# EAGLE schematic spectrometer (EAGLE 9.6.2)
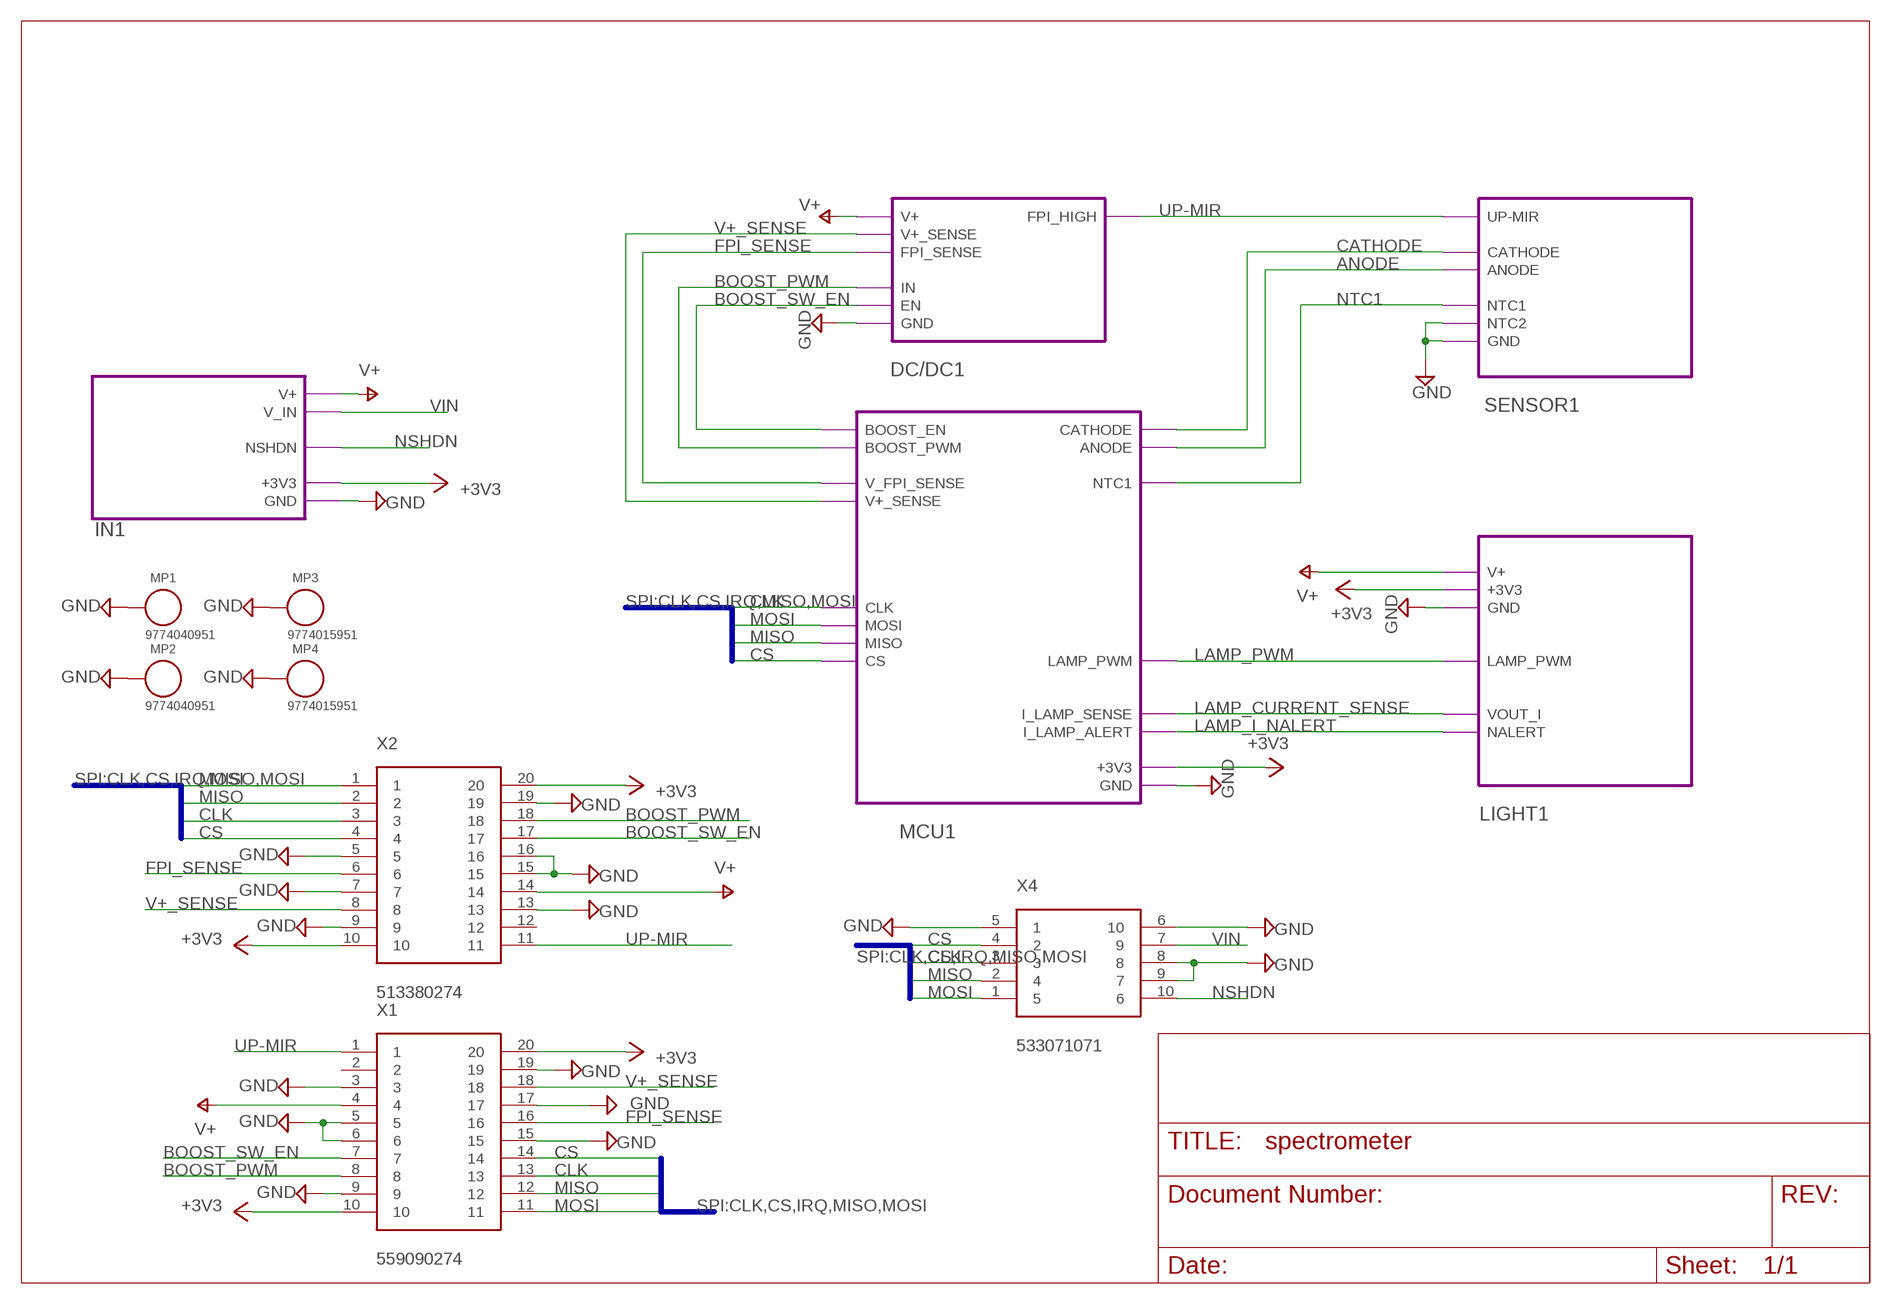
[diagram p0: schematic, sheet 1]

## Parts
MP1  9774040951  WA-SMST_9774XXX951_9774040951  [WA-SMST_9774040951]
MP2  9774040951  WA-SMST_9774XXX951_9774040951  [WA-SMST_9774040951]
MP3  9774015951  WA-SMST_9774XXX951_9774015951  [WA-SMST_9774015951]
MP4  9774015951  WA-SMST_9774XXX951_9774015951  [WA-SMST_9774015951]
X1  559090274  [559090274]
X2  513380274  513380274SIMPLE  [513380274]
X4  533071071  533071071SMD  [533071071]

## Module instances
DC/DC1 = VOLTAGE_BOOST
SENSOR1 = MEMS_FPI
IN1 = INPUT_VOLTAGE
MCU1 = MICROCONTROLLER
LIGHT1 = LIGHT_BULB

## Nets
+3V3: X1.10 X1.20 X2.10 X2.20 ; port LIGHT1.+3V3 MCU1.+3V3 IN1.+3V3
ANODE: port MCU1.ANODE SENSOR1.ANODE
BOOST_PWM: X1.8 X2.18 ; port DC/DC1.IN MCU1.BOOST_PWM
BOOST_SW_EN: X1.7 X2.17 ; port MCU1.BOOST_EN DC/DC1.EN
CATHODE: port SENSOR1.CATHODE MCU1.CATHODE
CLK: X1.13 X2.3 X4.3 ; port MCU1.CLK
CS: X1.14 X2.4 X4.4 ; port MCU1.CS
FPI_SENSE: X1.16 X2.6 ; port MCU1.V_FPI_SENSE DC/DC1.FPI_SENSE
GND: MP1.1 MP2.1 MP3.1 MP4.1 X1.3 X1.5 X1.6 X1.9 X1.15 X1.17 X1.19 X2.5 X2.7 X2.9 X2.13 X2.15 X2.16 X2.19 X4.5 X4.6 X4.8 X4.9 ; port SENSOR1.GND SENSOR1.NTC2 LIGHT1.GND DC/DC1.GND MCU1.GND IN1.GND
LAMP_CURRENT_SENSE: port LIGHT1.VOUT_I MCU1.I_LAMP_SENSE
LAMP_I_NALERT: port LIGHT1.NALERT MCU1.I_LAMP_ALERT
LAMP_PWM: port MCU1.LAMP_PWM LIGHT1.LAMP_PWM
MISO: X1.12 X2.2 X4.2 ; port MCU1.MISO
MOSI: X1.11 X2.1 X4.1 ; port MCU1.MOSI
NSHDN: X4.10 ; port IN1.NSHDN
NTC1: port SENSOR1.NTC1 MCU1.NTC1
UP-MIR: X1.1 X2.11 ; port SENSOR1.UP-MIR DC/DC1.FPI_HIGH
V+: X1.4 X2.14 ; port LIGHT1.V+ DC/DC1.V+ IN1.V+
V+_SENSE: X1.18 X2.8 ; port DC/DC1.V+_SENSE MCU1.V+_SENSE
VIN: X4.7 ; port IN1.V_IN
Unconnected: X1.2 X2.12

## Buses
SPI:CLK,CS,IRQ,MISO,MOSI

## Library data of the parts
MP1 MP2 = Wurth_Assembly_WA-SMST:WA-SMST_9774XXX951: WA-SMST SMT Steel Spacer Ø 2.7 Internal non stop Applications ple and fast automated assembly For distances from 1 to 10 mm With non stop internal diameter 2.7 mm High mechanical strength PROPERTIES Material Steel Surface Tin PACKAGING PROPERTIES Packaging Bag;​ Tape and Reel;​ Bulk Packaging Unit 450 <https://katalog.we-online.de/media/images/v2/o64624v209%20Family_SMD-Abstandsbolzen.jpg> Details see: https://katalog.we-online.de/en/em/SMST_SMD_STEEL_SPACER_2_7_INTERNAL_NON_STOP Updated by Ella Wu , 2020-05-18 2020 (C) Wurth Elektronik; DATASHEET-URL: https://www.we-online.com/catalog/datasheet/9774040951.pdf; HOLE-DIAMETER: 2.7mm; INNER-DIAMETER: 3.5mm; OUTER-DIAMETER: 5.1mm; PART-NUMBER: 9774040951; PIN-LENGTH: 4mm
MP3 MP4 = Wurth_Assembly_WA-SMST:WA-SMST_9774XXX951: WA-SMST SMT Steel Spacer Ø 2.7 Internal non stop Applications ple and fast automated assembly For distances from 1 to 10 mm With non stop internal diameter 2.7 mm High mechanical strength PROPERTIES Material Steel Surface Tin PACKAGING PROPERTIES Packaging Bag;​ Tape and Reel;​ Bulk Packaging Unit 450 <https://katalog.we-online.de/media/images/v2/o64624v209%20Family_SMD-Abstandsbolzen.jpg> Details see: https://katalog.we-online.de/en/em/SMST_SMD_STEEL_SPACER_2_7_INTERNAL_NON_STOP Updated by Ella Wu , 2020-05-18 2020 (C) Wurth Elektronik; DATASHEET-URL: https://www.we-online.com/catalog/datasheet/9774015951.pdf; HOLE-DIAMETER: 2.7mm; INNER-DIAMETER: 3.5mm; OUTER-DIAMETER: 5.1mm; PART-NUMBER: 9774015951; PIN-LENGTH: 1.5mm
X1 = connectors:559090274: 559090274 SlimStack Board-to-Board Plug, 0.40mm Pitch, J-Bend Series, 0.20µm Gold (Au) Plating, 1.50 or 1.80mm Mated Height, 3.40 or 4.20mm Mated Width, 20 Circuits
X2 = connectors:513380274: 513380274 SlimStack Board-to-Board Receptacle, 0.40mm Pitch, J-Bend Series, 0.20µm Gold (Au) Plating, 1.50 or 2.00mm Mated Height, 3.40mm Mated Width, 20 Circuits
X4 = connectors:533071071: 533071071 SlimStack Board-to-Board Connector, 0.80mm Pitch, Floating Series, Plug, 4.50 or 5.50mm Mated Height, 10 Circuits, Vertical, without Boss

## Module VOLTAGE_BOOST
Ports: FPI_HIGH(io) GND(io) V+(io) V+_SENSE(io) FPI_SENSE(io) IN(io) EN(io)
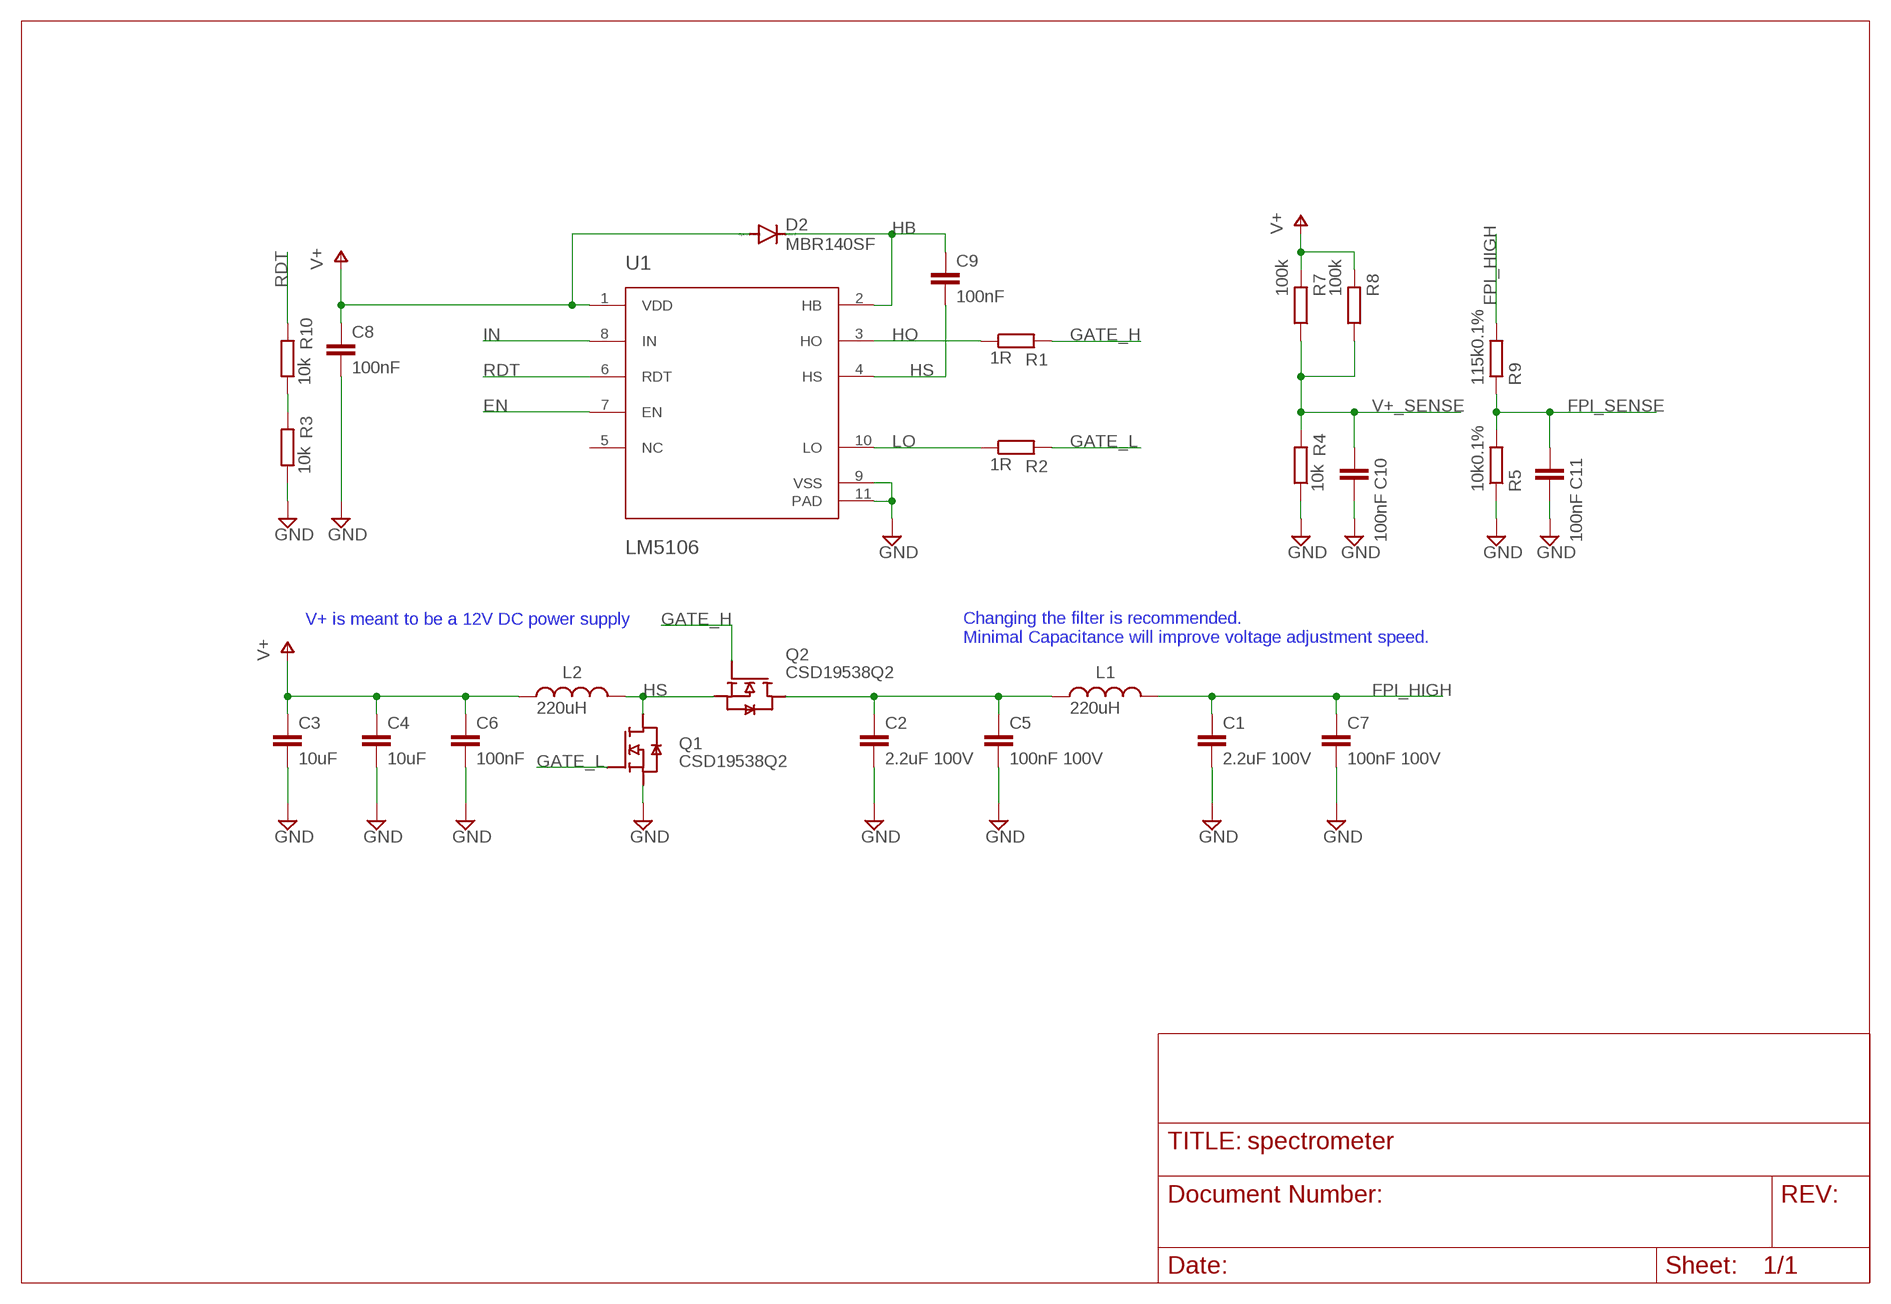
[diagram p1: schematic, module VOLTAGE_BOOST, sheet 1]

### Parts
C1  2.2uF 100V  C-EUC1210K  [C1210K]
C2  2.2uF 100V  C-EUC1210K  [C1210K]
C3  10uF  C-EUC1210K  [C1210K]
C4  10uF  C-EUC1210K  [C1210K]
C5  100nF 100V  C-EUC0603K  [C0603K]
C6  100nF  C-EUC0603K  [C0603K]
C7  100nF 100V  C-EUC0603K  [C0603K]
C8  100nF  C-EUC0603K  [C0603K]
C9  100nF  C-EUC0603K  [C0603K]
C10  100nF  C-EUC0402  [C0402]
C11  100nF  C-EUC0402  [C0402]
D2  MBR140SF  MBR0520LT  [SOD123]
L1  220uH  WE-LQ_1210_744032221  [WE-LQ_1210]
L2  220uH  WE-LQ_1210_744032221  [WE-LQ_1210]
Q1  CSD19538Q2  CSD19538Q2SON  [DQK0006C]
Q2  CSD19538Q2  CSD19538Q2SON  [DQK0006C]
R1  1R  R-EU_R0402  [R0402]
R2  1R  R-EU_R0402  [R0402]
R3  10k  R-EU_R0402  [R0402]
R4  10k  R-EU_R0402  [R0402]
R5  10k0.1%  R-EU_R0402  [R0402]
R7  100k  R-EU_R0402  [R0402]
R8  100k  R-EU_R0402  [R0402]
R9  115k0.1%  R-EU_R0402  [R0402]
R10  10k  R-EU_R0402  [R0402]
U1  LM5106  LM5106SD/NOPBWSON  [DPR0010A]

### Nets
EN: U1.7(EN)
FPI_HIGH: C1.1 C7.1 L1.2 R9.2
FPI_SENSE: C11.1 R5.2 R9.1
GATE_H: Q2.3(G) R1.2
GATE_L: Q1.3(G) R2.2
GND: C1.2 C2.2 C3.2 C4.2 C5.2 C6.2 C7.2 C8.2 C10.2 C11.2 Q1.4(S) Q1.7(S) R3.1 R4.1 R5.1 U1.9(VSS) U1.11(PAD)
HB: C9.1 D2.C U1.2(HB)
HO: R1.1 U1.3(HO)
HS: C9.2 L2.2 Q1.1(D) Q1.2(D) Q1.5(D) Q1.6(D) Q1.8(D) Q2.4(S) Q2.7(S) U1.4(HS)
IN: U1.8(IN)
LO: R2.1 U1.10(LO)
N$1: C2.1 C5.1 L1.1 Q2.1(D) Q2.2(D) Q2.5(D) Q2.6(D) Q2.8(D)
N$3: R3.2 R10.1
RDT: R10.2 U1.6(RDT)
V+: C3.1 C4.1 C6.1 C8.1 D2.A L2.1 R7.2 R8.2 U1.1(VDD)
V+_SENSE: C10.1 R4.2 R7.1 R8.1
Unconnected: U1.5(NC)

### Notes on the sheet
- V+ is meant to be a 12V DC power supply
- Changing the filter is recommended. 
  Minimal Capacitance will improve voltage adjustment speed.

### Library data of the parts
C1-C11 = rcl:C-EU: CAPACITOR, European symbol; SPICEPREFIX: C
D2 = diode:MBR0520LT: SCHOTTKY BARRIER RECTIFIER Source: http://onsemi.com .. MBR0520LT1-D.pdf
L1 L2 = Wurth_Power Magnetics_WE-LQ:WE-LQ_1210: WE-LQ SMD Inductor Characteristics Miniature chip inductor wound on a special ferrite core Small inductances for compact circuits High Q at high frequencies Low DC-resistance Operating temperature: –40 ºC to +125 ºC Recommended solder profile: Reflow Applications Low power DC/DC-converters from Linear Technology, National Semiconductor, Texas Instruments, Fairchild Semiconductor, ON Semiconductor, STMicroelectronics, Maxim, MPS, Semtech, Exar, Analogic Tech, Diodes and Cologne Chip EMI-Filtering RF-circuits <https://katalog.we-online.com/media/images/v2/o14806v209%20Family_we-lq_smd_induktivitaet.jpg> Details see: https://katalog.we-online.com/en/pbs/WE-LQ Updated by Yingchun Shan 2019-07-16 2019 (C) Wurth Elektronik; DATASHEET-URL: https://katalog.we-online.com/pbs/datasheet/744032221.pdf; FRES: 5MHz; IR: 0.075A; ISAT: 0.24A; PART-NUMBER: 744032221; Q: 40; RDC-MAX: 11.8Ohm
Q1 Q2 = spectrometer:CSD19538Q2; DATASHEET_URL: http://sps06.itg.ti.com/sites/KMS/crossdivteams/altium/docs/ComponentDatasheets/CSD19538Q2.pdf; IDSMAX: 15.0; MANUFACTURER_PART_NUMBER: CSD19538Q2; QGTYP: 7.2; QUANTITY: 1; RDSON45: 0.06608; VDSMAX: 100.0; VENDOR: Texas Instruments
R1-R5 R7-R10 = rcl:R-EU_: RESISTOR, European symbol; SPICEPREFIX: R
U1 = spectrometer:LM5106SD/NOPB: LM5106 The LM5106 is a high voltage gate driver designed to drive both the high side and low side N-Channel MOSFETs in a synchronous buck or half bridge configuration. The floating high side driver is capable of working with rail voltages up to 100V. The single control input is compatible with TTL signal levels and a single external resistor programs the switching transition dead-time through tightly matched turn-on delay circuits. The robust level shift technology operates at high speed while consuming low power and provides clean output transitions. Under-voltage lockout disables the gate driver when either the low side or the bootstrapped high side supply voltage is below the operating threshold. The LM5106 is offered in the VSSOP-10 or thermally enhanced 10-pin WSON plastic package.; MANUFACTURER: Texas Instruments; PARTNUMBER: LM5106SDX/NOPB; REFDES: RefDes; TYPE: TYPE

## Module MEMS_FPI
Ports: UP-MIR(io) ANODE(io) CATHODE(io) GND(io) NTC1(io) NTC2(io)
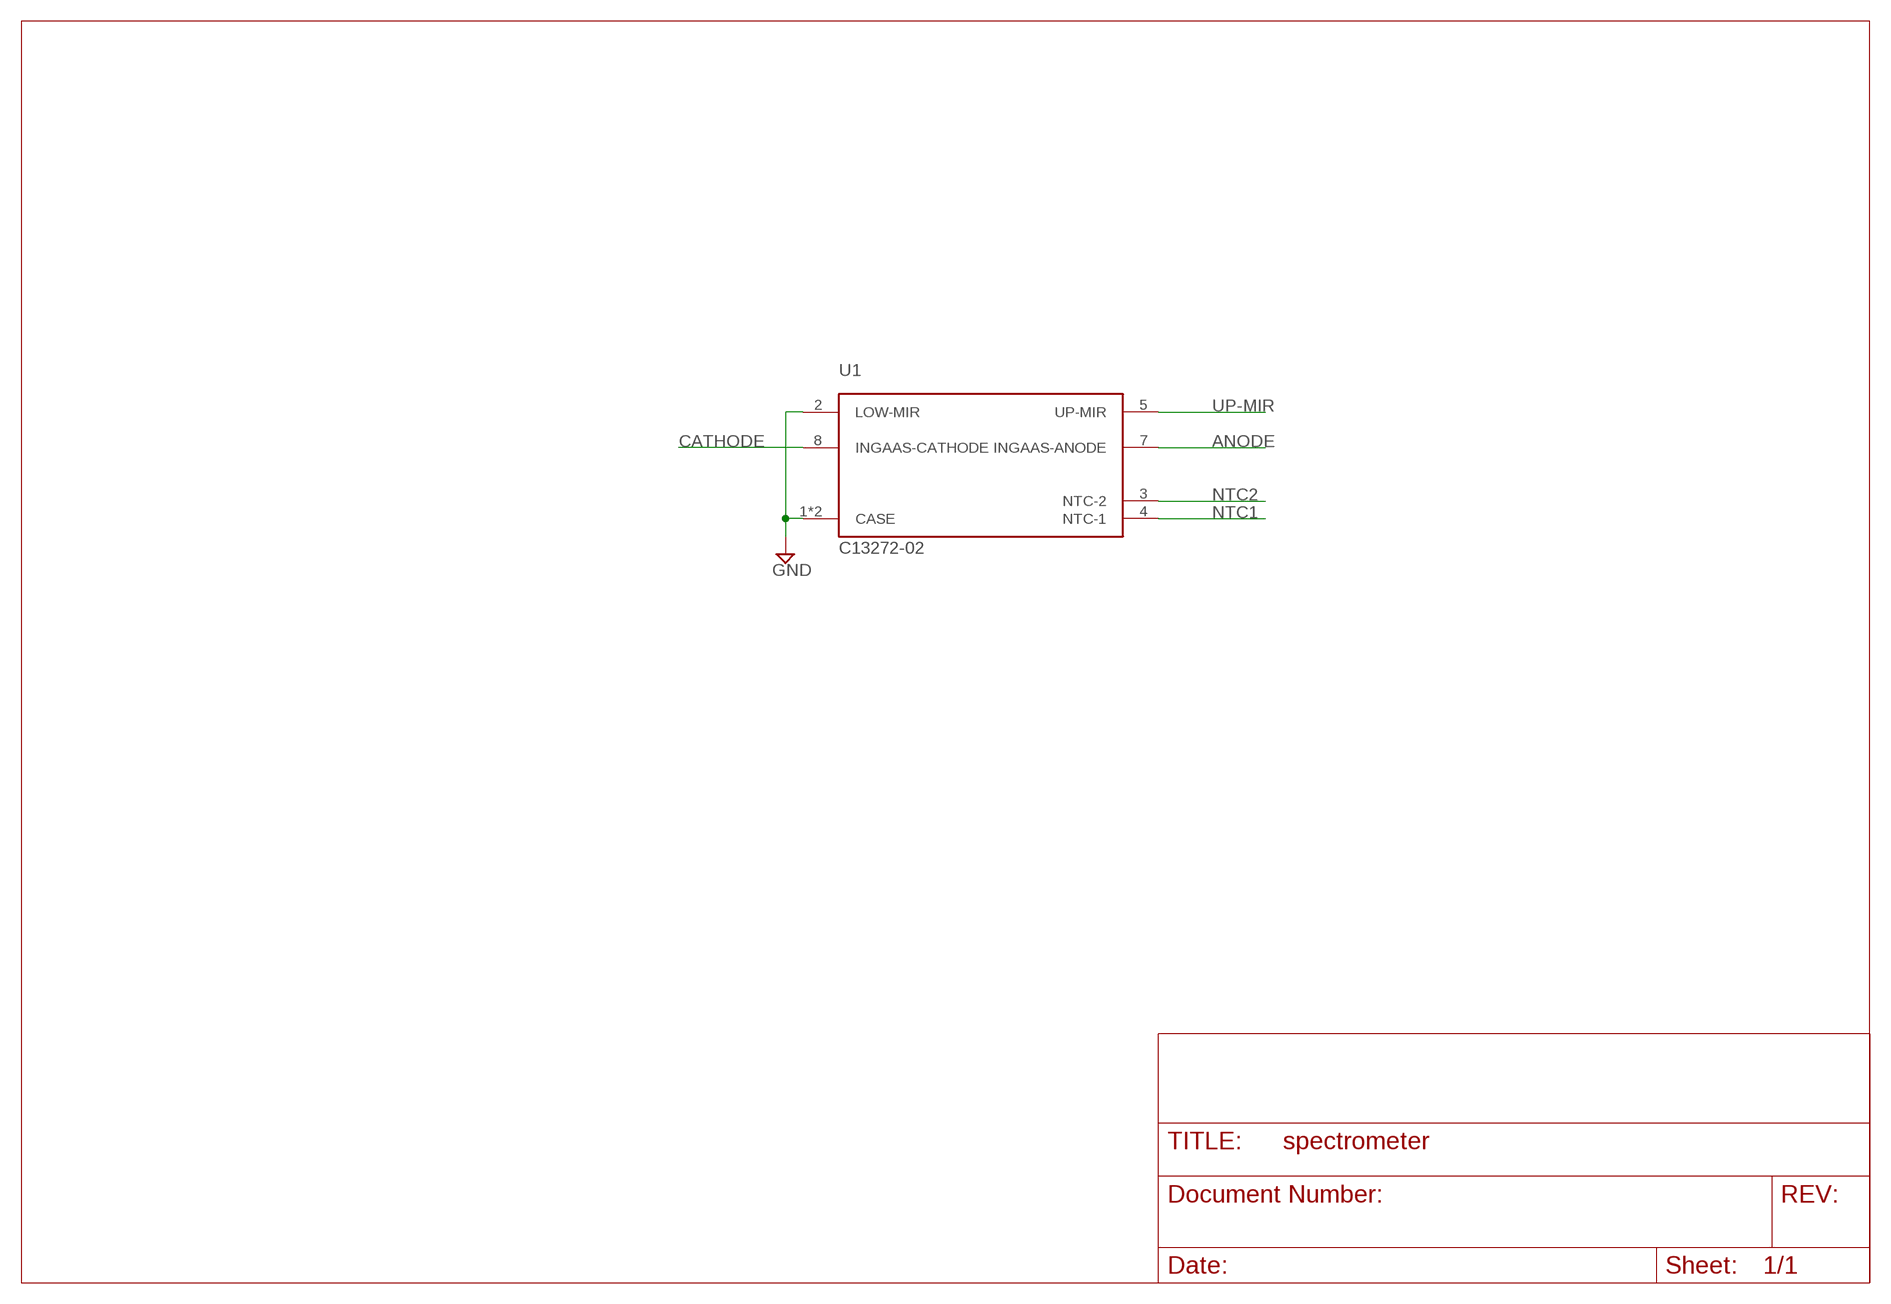
[diagram p2: schematic, module MEMS_FPI, sheet 1]

### Parts
U1  C13272-02  C13272-028PIN  [C13272-02]

### Nets
ANODE: U1.7(INGAAS-ANODE)
CATHODE: U1.8(INGAAS-CATHODE)
GND: U1.1(CASE) U1.2(LOW-MIR) U1.6(CASE)
NTC1: U1.4(NTC-1)
NTC2: U1.3(NTC-2)
UP-MIR: U1.5(UP-MIR)

### Library data of the parts
U1 = spectrometer:C13272-02: C13272-02 The MEMS-FPI spectrum sensor is a ultra-compact sensor that houses a MEMS-FPI (Fabry-Perot Interferometer) tunable filter that can vary its transmission wavelength depending on the applied voltage and InGaAs PIN photodiode in a single package. The spectral response range is 1550 to 1850 nm. It is suitable for installation in compact devices for identifying materials in plastic and solutions and other similar applications.

## Module INPUT_VOLTAGE
Ports: GND(io) +3V3(io) V+(io) V_IN(io) NSHDN(io)
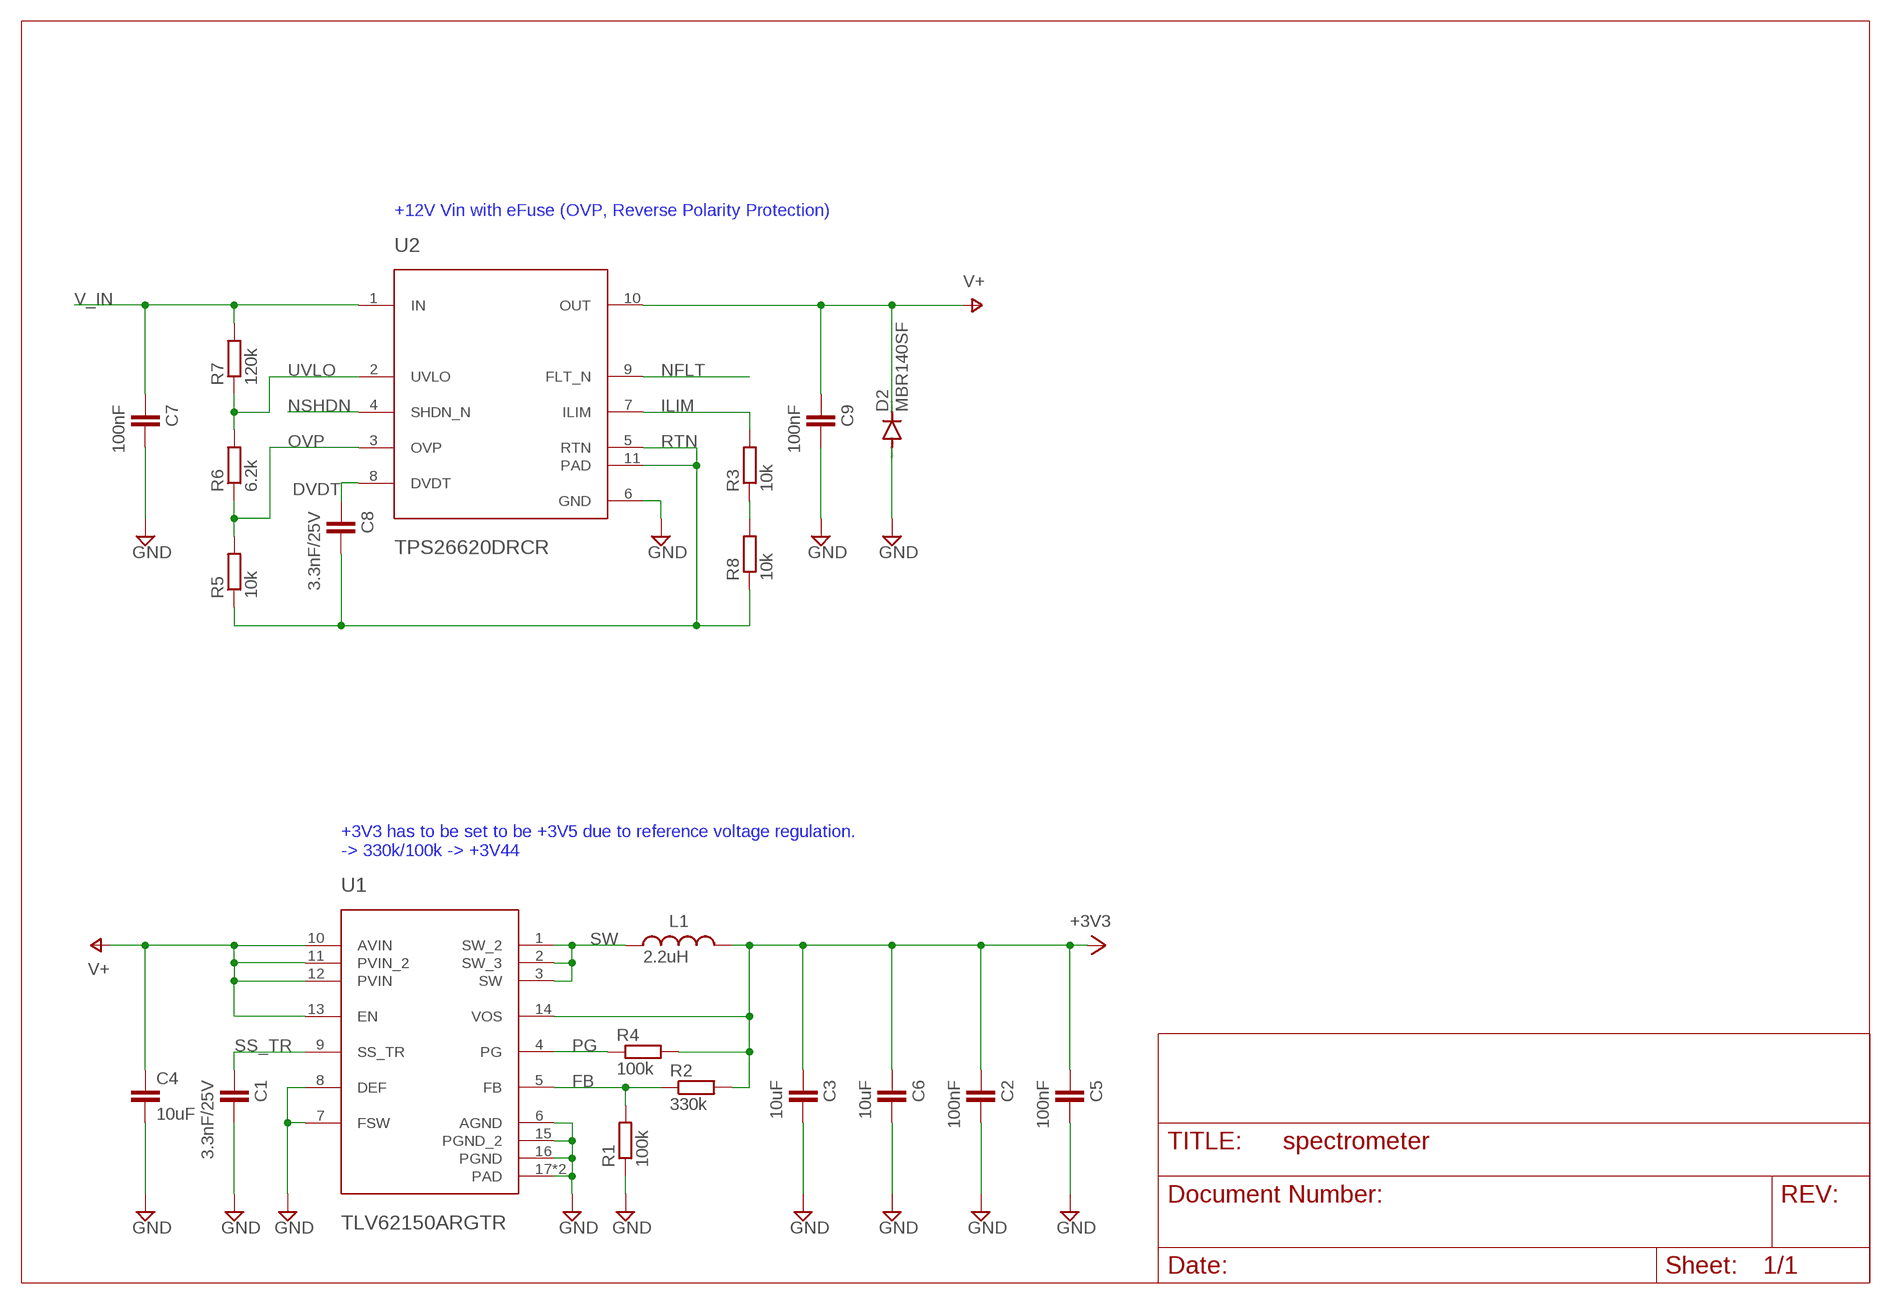
[diagram p3: schematic, module INPUT_VOLTAGE, sheet 1]

### Parts
C1  3.3nF/25V  C-EUC0402  [C0402]
C2  100nF  C-EUC0402  [C0402]
C3  10uF  C-EUC0603K  [C0603K]
C4  10uF  C-EUC1210K  [C1210K]
C5  100nF  C-EUC0402  [C0402]
C6  10uF  C-EUC0603K  [C0603K]
C7  100nF  C-EUC0603K  [C0603K]
C8  3.3nF/25V  C-EUC0402  [C0402]
C9  100nF  C-EUC0603K  [C0603K]
D2  MBR140SF  MBR0520LT  [SOD123]
L1  2.2uH  WE-LQ_1210_744032002  [WE-LQ_1210]
R1  100k  R-EU_R0402  [R0402]
R2  330k  R-EU_R0402  [R0402]
R3  10k  R-EU_R0402  [R0402]
R4  100k  R-EU_R0402  [R0402]
R5  10k  R-EU_R0402  [R0402]
R6  6.2k  R-EU_R0402  [R0402]
R7  120k  R-EU_R0402  [R0402]
R8  10k  R-EU_R0402  [R0402]
U1  TLV62150ARGTR  TLV62150ARGTRQFN16  [RGT0016C]
U2  TPS26620DRCR  TPS26620DRCRQFN-10  [DRC0010J]

### Nets
+3V3: C2.1 C3.1 C5.1 C6.1 L1.2 R2.2 R4.2 U1.14(VOS)
DVDT: C8.1 U2.8(DVDT)
FB: R1.2 R2.1 U1.5(FB)
GND: C1.2 C2.2 C3.2 C4.2 C5.2 C6.2 C7.2 C9.2 D2.A R1.1 U1.6(AGND) U1.7(FSW) U1.8(DEF) U1.15(PGND_2) U1.16(PGND) U1.17(PAD) U1.18(PAD) U2.6(GND)
ILIM: R3.2 U2.7(ILIM)
N$3: R3.1 R8.2
NFLT: U2.9(FLT_N)
NSHDN: U2.4(SHDN_N)
OVP: R5.2 R6.1 U2.3(OVP)
PG: R4.1 U1.4(PG)
RTN: C8.2 R5.1 R8.1 U2.5(RTN) U2.11(PAD)
SS_TR: C1.1 U1.9(SS_TR)
SW: L1.1 U1.1(SW_2) U1.2(SW_3) U1.3(SW)
UVLO: R6.2 R7.1 U2.2(UVLO)
V+: C4.1 C9.1 D2.C U1.10(AVIN) U1.11(PVIN_2) U1.12(PVIN) U1.13(EN) U2.10(OUT)
V_IN: C7.1 R7.2 U2.1(IN)

### Notes on the sheet
- +12V Vin with eFuse (OVP, Reverse Polarity Protection)
- +3V3 has to be set to be +3V5 due to reference voltage regulation.
  -> 330k/100k -> +3V44

### Library data of the parts
C1-C9 = rcl:C-EU: CAPACITOR, European symbol; SPICEPREFIX: C
D2 = diode:MBR0520LT: SCHOTTKY BARRIER RECTIFIER Source: http://onsemi.com .. MBR0520LT1-D.pdf
L1 = Wurth_Power Magnetics_WE-LQ:WE-LQ_1210: WE-LQ SMD Inductor Characteristics Miniature chip inductor wound on a special ferrite core Small inductances for compact circuits High Q at high frequencies Low DC-resistance Operating temperature: –40 ºC to +125 ºC Recommended solder profile: Reflow Applications Low power DC/DC-converters from Linear Technology, National Semiconductor, Texas Instruments, Fairchild Semiconductor, ON Semiconductor, STMicroelectronics, Maxim, MPS, Semtech, Exar, Analogic Tech, Diodes and Cologne Chip EMI-Filtering RF-circuits <https://katalog.we-online.com/media/images/v2/o14806v209%20Family_we-lq_smd_induktivitaet.jpg> Details see: https://katalog.we-online.com/en/pbs/WE-LQ Updated by Yingchun Shan 2019-07-16 2019 (C) Wurth Elektronik; DATASHEET-URL: https://katalog.we-online.com/pbs/datasheet/744032002.pdf; FRES: 50MHz; IR: 0.62A; ISAT: 1.8A; PART-NUMBER: 744032002; Q: 20; RDC-MAX: 0.15Ohm
R1-R8 = rcl:R-EU_: RESISTOR, European symbol; SPICEPREFIX: R
U1 = spectrometer:TLV62150ARGTR: TLV62150x The TLV62150x device is an easy-to-use synchronous step-down DC-DC converter optimized for applications with high power density. A high switching frequency of typically 2.5 MHz allows the use of small inductors and provides fast transient response as well as high output voltage accuracy by use of the DCS-ControlTM topology. With their wide operating input voltage range of 4 V to 17 V, the devices are ideally suited for systems powered from either a Li-Ion or other batteries as well as from 12 V intermediate power rails. It supports up to 1-A continuous output current at output voltages between 0.9 V and 5 V (with 100% duty cycle mode). The output voltage startup ramp is controlled by the soft-start pin, which allows operation as either a standalone power supply or in tracking configurations. Power sequencing is also possible by configuring the Enable and open-drain Power Good pins. In Power Save Mode, the devices draw quiescent current of about 19 μA from VIN. Power Save Mode, entered automatically and seamlessly if load is small, maintains high efficiency over the entire load range. In Shutdown Mode, the device is turned off and shutdown current consumption is less than 2 μA. The devices is packaged in a 16-pin VQFN package measuring 3 mm × 3 mm (RGT).; MANUFACTURER: Texas Instruments; PARTNUMBER: TLV62150ARGTR; REFDES: RefDes; TYPE: TYPE; VALUE: Value
U2 = spectrometer:TPS26620DRCR: TPS2662x The TPS2662x family are compact, feature rich high voltage eFuses with a full suite of protection features. The wide supply input range of 4.5 V to 60 V allows control of many popular DC bus voltages. The device can withstand and protect the loads from positive and negative supply voltages up to ±60 V. The TPS26624 and TPS26625 devices support both input as well as output reverse polarity protection feature. Integrated back to back FETs provide reverse current blocking feature making the device suitable for systems with output voltage holdup requirements during power fail and brownout conditions. Load, source and device protection are provided with many adjustable features including overcurrent, output slew rate and overvoltage, undervoltage thresholds. The internal robust protection control blocks along with the high voltage rating of the TPS2662x family helps to simplify the system designs for Surge protection. The TPS26620, TPS26622 and TPS26624 feature Latch off and TPS26621, TPS26623 and TPS26625 feature Auto-Retry functionality are the over temperature and over current fault events. The devices are available in a 3 mm × 3 mm 10-pin SON package and are specified over a –40°C to +125°C temperature range.; MANUFACTURER: Texas Instruments; PARTNUMBER: TPS26623DRCR; REFDES: RefDes; TYPE: TYPE; VALUE: Value

## Module MICROCONTROLLER
Ports: GND(io) CATHODE(io) NTC1(io) BOOST_EN(io) V_FPI_SENSE(io) V+_SENSE(io) LAMP_PWM(io) I_LAMP_SENSE(io) I_LAMP_ALERT(io) BOOST_PWM(io) ANODE(io) CLK(io) MOSI(io) MISO(io) CS(io) +3V3(io)
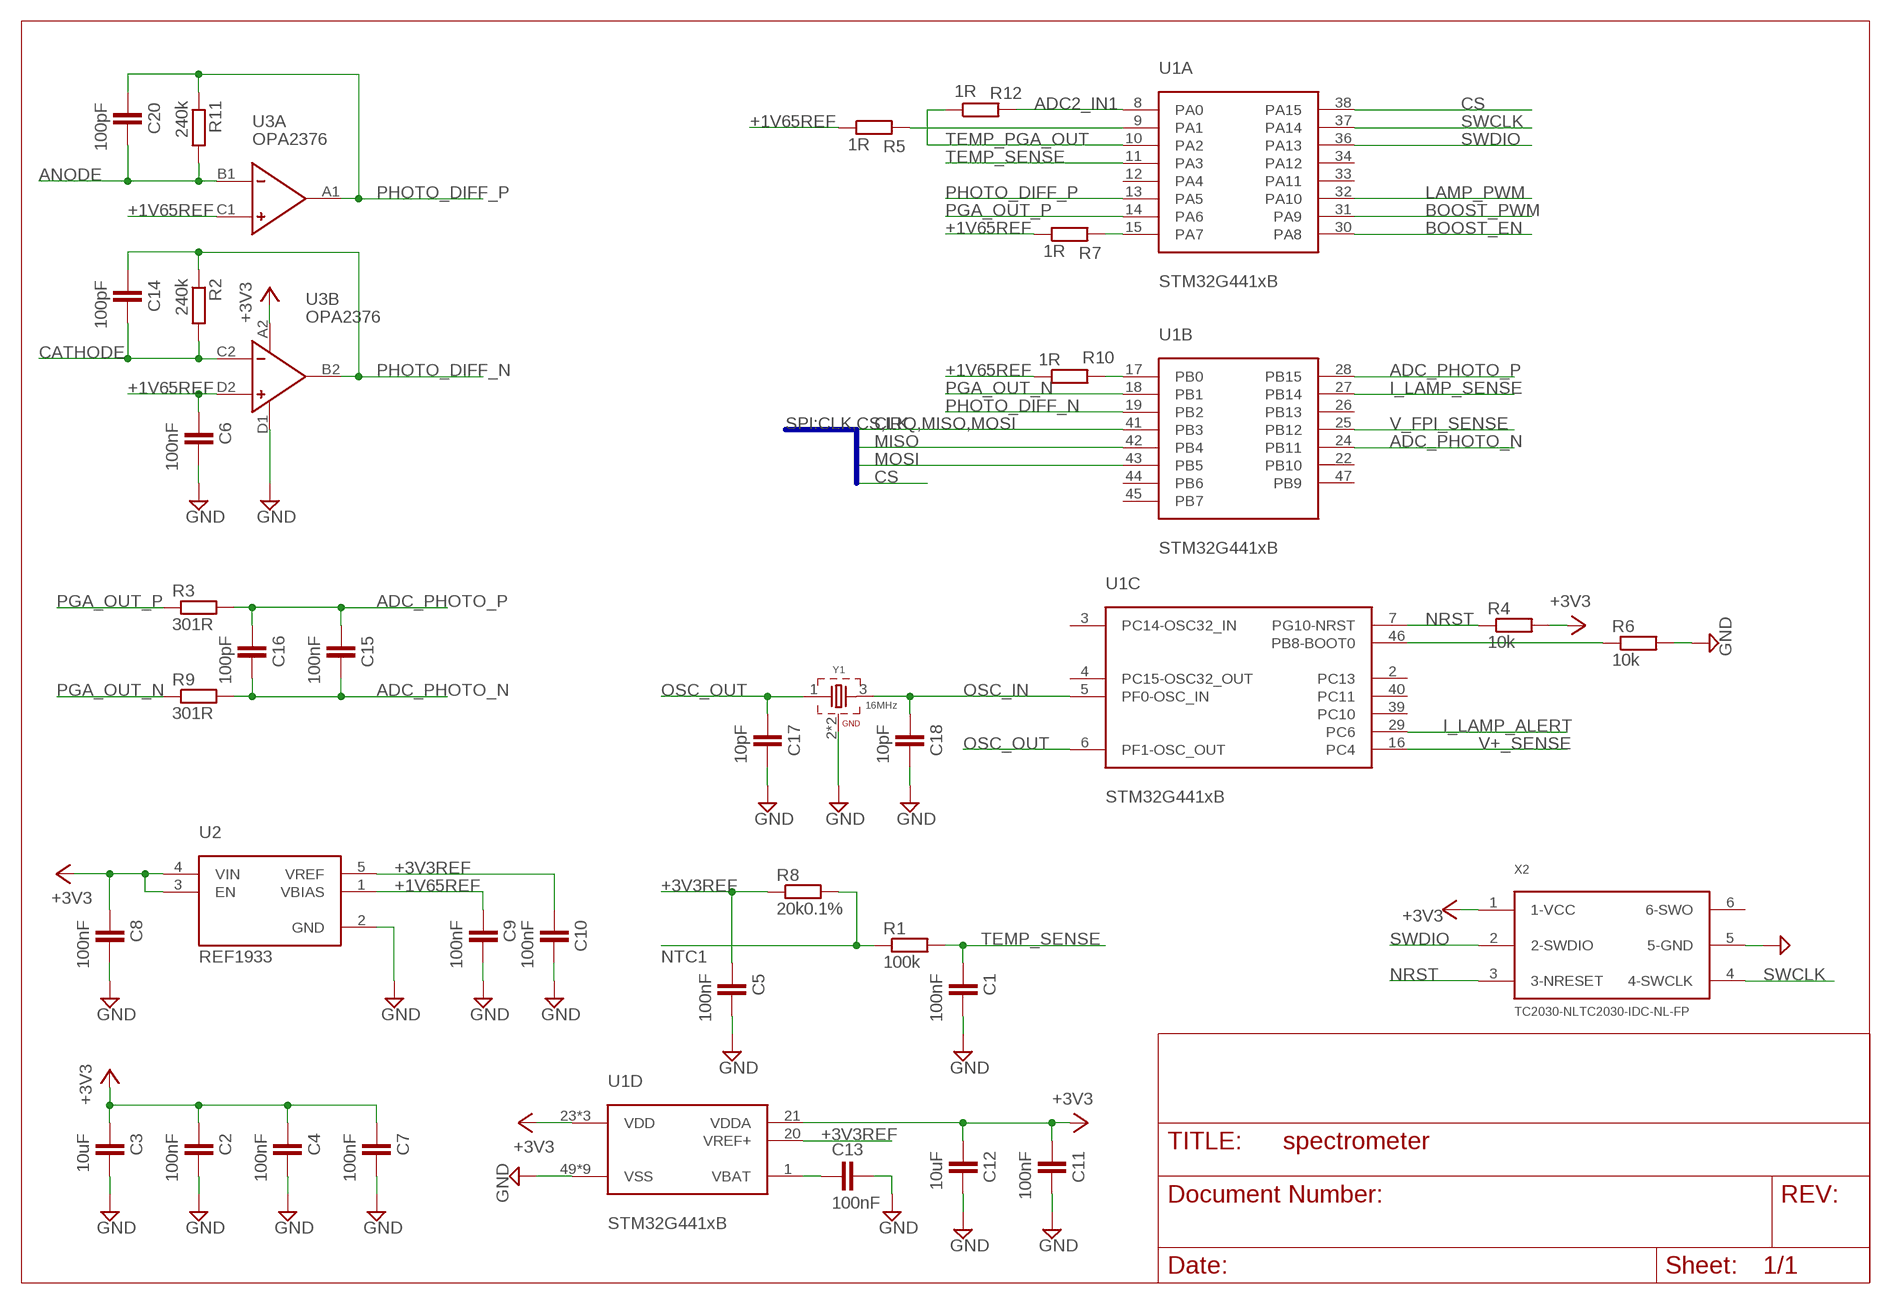
[diagram p4: schematic, module MICROCONTROLLER, sheet 1]

### Parts
C1  100nF  C-EUC0402  [C0402]
C2  100nF  C-EUC0402  [C0402]
C3  10uF  C-EUC0603K  [C0603K]
C4  100nF  C-EUC0402  [C0402]
C5  100nF  C-EUC0402  [C0402]
C6  100nF  C-EUC0402  [C0402]
C7  100nF  C-EUC0402  [C0402]
C8  100nF  C-EUC0402  [C0402]
C9  100nF  C-EUC0402  [C0402]
C10  100nF  C-EUC0402  [C0402]
C11  100nF  C-EUC0402  [C0402]
C12  10uF  C-EUC0603K  [C0603K]
C13  100nF  C-EUC0402  [C0402]
C14  100pF  C-EUC0402  [C0402]
C15  100nF  C-EUC0402  [C0402]
C16  100pF  C-EUC0402  [C0402]
C17  10pF  C-EUC0402  [C0402]
C18  10pF  C-EUC0402  [C0402]
C20  100pF  C-EUC0402  [C0402]
R1  100k  R-EU_R0402  [R0402]
R2  240k  R-EU_R0402  [R0402]
R3  301R  R-EU_R0402  [R0402]
R4  10k  R-EU_R0402  [R0402]
R5  1R  R-EU_R0402  [R0402]
R6  10k  R-EU_R0402  [R0402]
R7  1R  R-EU_R0402  [R0402]
R8  20k0.1%  R-EU_R0402  [R0402]
R9  301R  R-EU_R0402  [R0402]
R10  1R  R-EU_R0402  [R0402]
R11  240k  R-EU_R0402  [R0402]
R12  1R  R-EU_R0402  [R0402]
U1  STM32G441xB  STM32G441XBUFQFPN48  [QFN50P700X700X100-49T560N]
U2  REF1933  REF1933SOT5  [SOT95P280X110-5N]
U3  OPA2376  OPA2376DSBGA  [BGA8C50P2X4_215X111X62N]
X2  TC2030-NLTC2030-IDC-NL-FP  [TC2030-NL]
Y1  16MHz  WE-XTAL_CFPX-218_830069392  [WE-XTAL_CFPX-218]

### Nets
+1V65REF: C6.1 C9.1 R5.1 R7.1 R10.1 U2.1(VBIAS) U3.C1(A:IN+) U3.D2(B:IN+)
+3V3: C2.1 C3.1 C4.1 C7.1 C8.1 C11.1 C12.1 R4.2 U1.21(D:VDDA) U1.23(D:VDD) U1.35(D:VDD) U1.48(D:VDD) U2.3(EN) U2.4(VIN) U3.A2(B:V+) X2.1(1-VCC)
+3V3REF: C5.1 C10.1 R8.1 U1.20(D:VREF+) U2.5(VREF)
ADC2_IN1: R12.2 U1.8(A:PA0)
ADC_PHOTO_N [differential]: C15.2 C16.2 R9.2 U1.24(B:PB11)
ADC_PHOTO_P [differential]: C15.1 C16.1 R3.2 U1.28(B:PB15)
ANODE: C20.2 R11.2 U3.B1(A:IN-)
BOOST_EN: U1.30(A:PA8)
BOOST_PWM: U1.31(A:PA9)
CATHODE: C14.2 R2.2 U3.C2(B:IN-)
CLK: U1.41(B:PB3)
CS: U1.38(A:PA15)
GND: C1.2 C2.2 C3.2 C4.2 C5.2 C6.2 C7.2 C8.2 C9.2 C10.2 C11.2 C12.2 C13.2 C17.2 C18.2 R6.2 U1.49(D:VSS) U1.50(D:VSS) U1.51(D:VSS) U1.52(D:VSS) U1.53(D:VSS) U1.54(D:VSS) U1.55(D:VSS) U1.56(D:VSS) U1.57(D:VSS) U2.2(GND) U3.D1(B:GND) X2.5(5-GND) Y1.2(GND) Y1.4(GND)
I_LAMP_ALERT: U1.29(C:PC6)
I_LAMP_SENSE: U1.27(B:PB14)
LAMP_PWM: U1.32(A:PA10)
MISO: U1.42(B:PB4)
MOSI: U1.43(B:PB5)
N$1: R6.1 U1.46(C:PB8-BOOT0)
N$2: C13.1 U1.1(D:VBAT)
N$3: R7.2 U1.15(A:PA7)
N$4: R10.2 U1.17(B:PB0)
N$6: R5.2 U1.9(A:PA1)
NRST: R4.1 U1.7(C:PG10-NRST) X2.3(3-NRESET)
NTC1: R1.1 R8.2
OSC_IN: C18.1 U1.5(C:PF0-OSC_IN) Y1.3
OSC_OUT: C17.1 U1.6(C:PF1-OSC_OUT) Y1.1
PGA_OUT_N [differential]: R9.1 U1.18(B:PB1)
PGA_OUT_P [differential]: R3.1 U1.14(A:PA6)
PHOTO_DIFF_N [differential]: C14.1 R2.1 U1.19(B:PB2) U3.B2(B:OUT)
PHOTO_DIFF_P [differential]: C20.1 R11.1 U1.13(A:PA5) U3.A1(A:OUT)
SWCLK: U1.37(A:PA14) X2.4(4-SWCLK)
SWDIO: U1.36(A:PA13) X2.2(2-SWDIO)
TEMP_PGA_OUT: R12.1 U1.10(A:PA2)
TEMP_SENSE: C1.1 R1.2 U1.11(A:PA3)
V+_SENSE: U1.16(C:PC4)
V_FPI_SENSE: U1.25(B:PB12)
Unconnected: U1.2(C:PC13) U1.3(C:PC14-OSC32_IN) U1.4(C:PC15-OSC32_OUT) U1.12(A:PA4) U1.22(B:PB10) U1.26(B:PB13) U1.33(A:PA11) U1.34(A:PA12) U1.39(C:PC10) U1.40(C:PC11) U1.44(B:PB6) U1.45(B:PB7) U1.47(B:PB9) X2.6(6-SWO)

### Buses
SPI:CLK,CS,IRQ,MISO,MOSI

### Library data of the parts
C1-C18 C20 = rcl:C-EU: CAPACITOR, European symbol; SPICEPREFIX: C
R1-R12 = rcl:R-EU_: RESISTOR, European symbol; SPICEPREFIX: R
U1 = spectrometer:STM32G441XB: STM32G441xB The STM32G441xB devices are based on the high-performance Arm® Cortex®-M4 32-bit RISC core. They operate at a frequency of up to 170 MHz. The Cortex-M4 core features a single-precision floating-point unit (FPU), which supports all the Arm single-precision data-processing instructions and all the data types. It also implements a full set of DSP (digital signal processing) instructions and a memory protection unit (MPU) which enhances the application’s security. These devices embed high-speed memories (128 Kbytes of Flash memory, and 32 Kbytes of SRAM), an extensive range of enhanced I/Os and peripherals connected to two APB buses, two AHB buses and a 32-bit multi-AHB bus matrix. The devices also embed several protection mechanisms for embedded Flash memory and SRAM: readout protection, write protection, securable memory area and proprietary code readout protection. The devices embed peripherals allowing mathematical/arithmetic function acceleration (CORDIC for trigonometric functions and FMAC unit for filter functions). They offer two fast 12-bit ADCs (5 Msps), four comparators, three operational amplifiers, four DAC channels (2 external and 2 internal), an internal voltage reference buffer, a lowpower RTC, one general-purpose 32-bit timers, two 16-bit PWM timers dedicated to motor control, seven general-purpose 16-bit timers, and one 16-bit low-power timer. They also feature standard and advanced communication interfaces such as: • Three I2Cs • Three SPIs multiplexed with two half duplex I2Ss • Three USARTs, one UART and one low-power UART. • One FDCAN • One SAI • USB device • UCPD The STM32G441xB devices embed an AES. The devices operate in the -40 to +85 °C (+105 °C junction) and -40 to +125 °C (+130 °C junction) temperature ranges from a 1.71 to 3.6 V power supply. A comprehensive set of power-saving modes allows the design of low-power applications. Some independent power supplies are supported including an analog independent supply input for ADC, DAC, OPAMPs and comparators. A VBAT input allows backup of the RTC and the registers. The STM32G441xB family offers 9 packages from 32-pin to 100-pin.
U2 = spectrometer:REF1933: REF1933 Applications with only a positive supply voltage often require an additional stable voltage in the middle of the analog-to-digital converter (ADC) input range to bias input bipolar signals. The REF19xx provides a reference voltage (VREF) for the ADC and a second highly-accurate voltage (VBIAS) that can be used to bias the input bipolar signals. The REF19xx offers excellent temperature drift (25 ppm/°C, max) and initial accuracy (0.1%) on both the VREF and VBIAS outputs while operating at a quiescent current less than 430 μA. In addition, the VREF and VBIAS outputs track each other with a precision of 6 ppm/°C (max) across the temperature range of –40°C to 85°C. All these features increase the precision of the signal chain and decrease board space, while reducing the cost of the system as compared to a discrete solution. Extremely low dropout voltage of only 10 mV allows operation from very low input voltages, which can be very useful in battery-operated systems. Both the VREF and VBIAS voltages have the same excellent specifications and can sink and source current equally well. Very good long-term stability and low noise levels make these devices ideally-suited for high-precision industrial applications.
U3 = spectrometer:OPA2376: OPA2376 The OPA376 family represents a new generation of low-noise operational amplifiers with e-trimTM, offering outstanding dc precision and ac performance. Rail-to- rail input and output, low offset (25 μV, maximum), low noise (7.5 nV/√Hz), quiescent current of 950 μA (maximum), and a 5.5-MHz bandwidth make this part very attractive for a variety of precision and portable applications. In addition, this device has a reasonably wide supply range with excellent PSRR, making it attractive for applications that run directly from batteries without regulation. The OPA376 (single version) is available in MicroSIZE SC70-5, SOT-23-5, and SOIC-8 packages. The OPA2376 (dual) is offered in the DSBGA-8, VSSOP-8, and SOIC-8 packages. The OPA4376 (quad) is offered in a TSSOP-14 package. All versions are specified for operation from –40°C to +125°C.
X2 = connectors:TC2030-NL
Y1 = Wurth_Quartz Crystals & Oscillators_WE-XTAL:WE-XTAL_CFPX-218: WE-XTAL Quartz Crystal Characteristics Industry standard packages <https://katalog.we-online.com/media/images/v2/o135919v209%20Family_WE-XTAL_IQXC-42.jpg> Details see: https://katalog.we-online.com/en/pbs/WE-XTAL Updated by Ella Wu , 2019-09-03 2019 (C) Wurth Elektronik; C-LOAD: 10pF; DATASHEET-URL: https://www.we-online.com/catalog/datasheet/830069392.pdf; MOUNT: SMT; PART-NUMBER: 830069392; STABILITY: 20ppm; TOLERANCE: ±20ppm

## Module LIGHT_BULB
Ports: V+(io) +3V3(io) GND(io) VOUT_I(io) NALERT(io) LAMP_PWM(io)
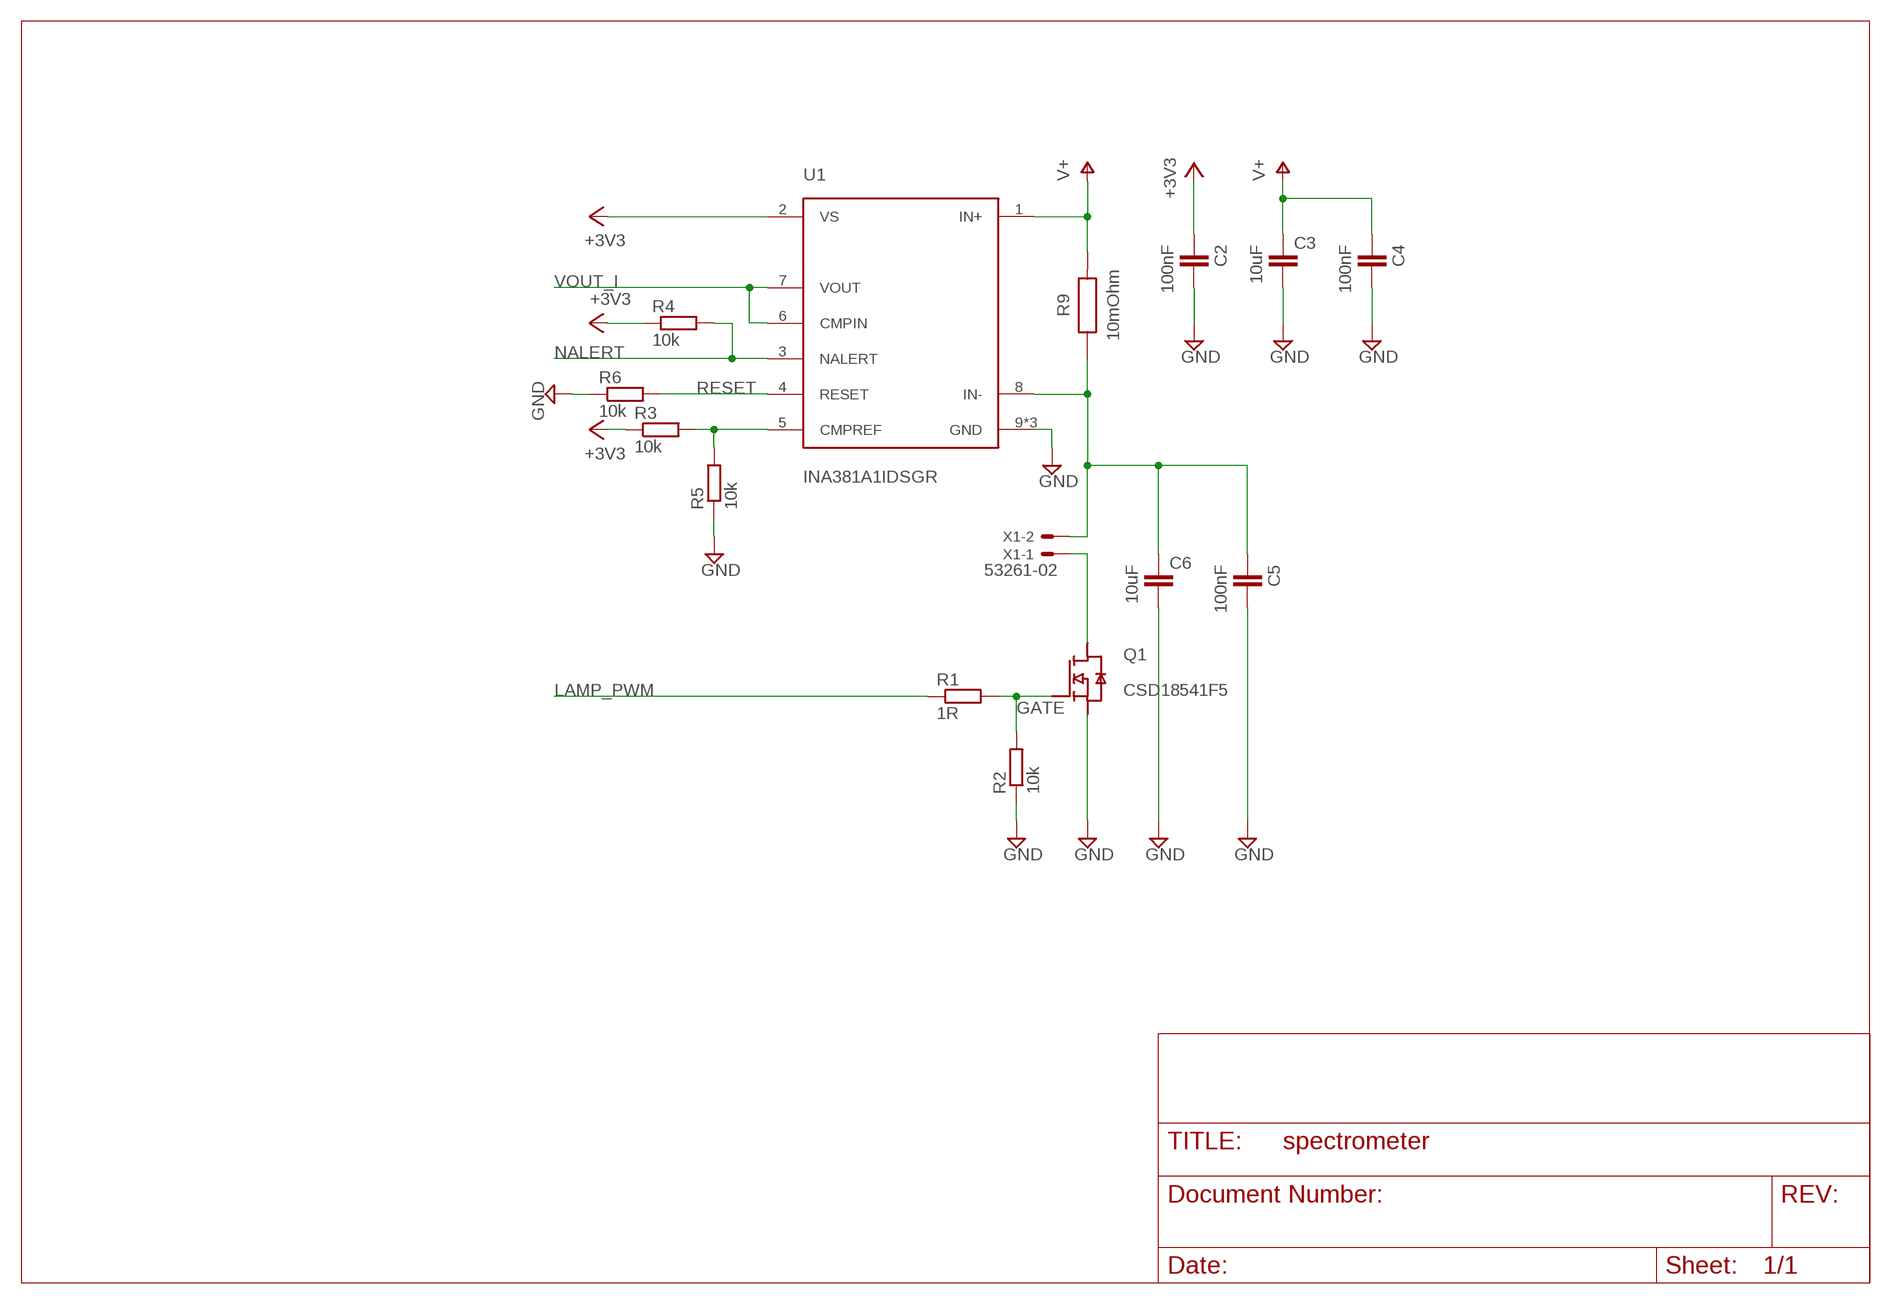
[diagram p5: schematic, module LIGHT_BULB, sheet 1]

### Parts
C2  100nF  C-EUC0402  [C0402]
C3  10uF  C-EUC0805K  [C0805K]
C4  100nF  C-EUC0603K  [C0603K]
C5  100nF  C-EUC0603K  [C0603K]
C6  10uF  C-EUC0805K  [C0805K]
Q1  CSD18541F5  CSD18541F5LGA  [CSD18541F5]
R1  1R  R-EU_R0402  [R0402]
R2  10k  R-EU_R0402  [R0402]
R3  10k  R-EU_R0402  [R0402]
R4  10k  R-EU_R0402  [R0402]
R5  10k  R-EU_R0402  [R0402]
R6  10k  R-EU_R0402  [R0402]
R9  10mOhm  WRIS-PSMB_0603_580060716002_1.6X0.8X0.3X0.3  [WRIS-PSMB_0603_1.6X0.8X0.3X0.3(LXWXHXPW)]
U1  INA381A1IDSGR  INA381WSON  [SON50P200X200X80-9T90X160N]
X1  53261-02  [53261-02]

### Nets
+3V3: C2.1 R3.1 R4.1 U1.2(VS)
GATE: Q1.1(G) R1.2 R2.2
GND: C2.2 C3.2 C4.2 C5.2 C6.2 Q1.2(S) R2.1 R5.1 R6.1 U1.9(GND) U1.10(GND) U1.11(GND)
LAMP_PWM: R1.1
N$1: Q1.3(D) X1.1
N$2: C5.1 C6.1 R9.1 U1.8(IN-) X1.2
N$10: R3.2 R5.2 U1.5(CMPREF)
NALERT: R4.2 U1.3(NALERT)
RESET: R6.2 U1.4(RESET)
V+: C3.1 C4.1 R9.2 U1.1(IN+)
VOUT_I: U1.6(CMPIN) U1.7(VOUT)

### Library data of the parts
C2-C6 = rcl:C-EU: CAPACITOR, European symbol; SPICEPREFIX: C
Q1 = spectrometer:CSD18541F5: CSD18541F5 This 54-mΩ, 60-V, N-Channel FemtoFETTM MOSFET technology is designed and optimized to minimize the footprint in many space constrained industrial load switch applications. This technology is capable of replacing standard small signal MOSFETs while providing a significant reduction in footprint size.
R1-R6 = rcl:R-EU_: RESISTOR, European symbol; SPICEPREFIX: R
R9 = Wurth_Resistor_WRIS-PSMB:WRIS-PSMB_0603: WRIS-PSMB Metal Plate Resistors Characteristics Metal plate resistors Recommended soldering: Reflow Operating temperature: -55 °C up to +155 °C Resistance range: 5 mΩ up to 10 mΩ Resistance tolerance: ±1 % Rated power: 0.33 W up to 1 W Enhanced current sensing Applications DMotor control Package name and Variant abbreviation: L X W X H X PW =Length X Width X Height X Pad Width <https://katalog.we-online.com/media/images/v2/o135743v209%20Family_WRIS-PSMB.jpg> Details see: https://katalog.we-online.com/en/pbs/WRIS-PSMB Created by Yingchun, Shan 2018-11-14 2018(C) Wurth Elektronik; DATASHEET-URL: https://katalog.we-online.de/pbs/datasheet/580060716002.pdf; IR: 5.74A; MOUNT: SMT; PART-NUMBER: 580060716002; PRATED: 0.33W; TCR: ±100ppm/ °C; TECHNICAL-REFERENCE: MB0603R010F103KAATP0000
U1 = spectrometer:INA381: INA381 The INA381 includes both a 26-V common-mode, current-sensing amplifier and a high-speed comparator. This device detects overcurrent conditions by measuring the voltage developed across a current-shunt resistor and comparing that voltage to a user-defined threshold limit set by the comparator reference pin. The current-shunt monitor can measure differential voltage signals on commonmode voltages that vary from –0.2 V up to 26 V, independent of the supply voltage. The open-drain alert output can be configured to operate in two modes: transparent or latched. In transparent mode, the output status follows the input state. In latched mode, the alert output is cleared only when the latch is reset. The standalone comparator large-signal alert response time is less than 2 μs, allowing for quick detection of overcurrent events. The total system overcurrent protection response time provided by the INA381 is less than 10 μs. This device operates from a single 2.7-V to 5.5-V supply, drawing a maximum supply current of 350 μA. The device is specified over an operating temperature range of –40°C to +125°C, and is available in 8-pin WSON and 10-pin VSSOP packages.
X1 = connectors:53?-02: CONNECTOR wire to board 1.25 mm (.049 inch) pitch header; MF: MOLEX; OC_FARNELL: 1125373; OC_NEWARK: unknown